# EAGLE design multi_sense32_re1 (EAGLE 9.6.2)
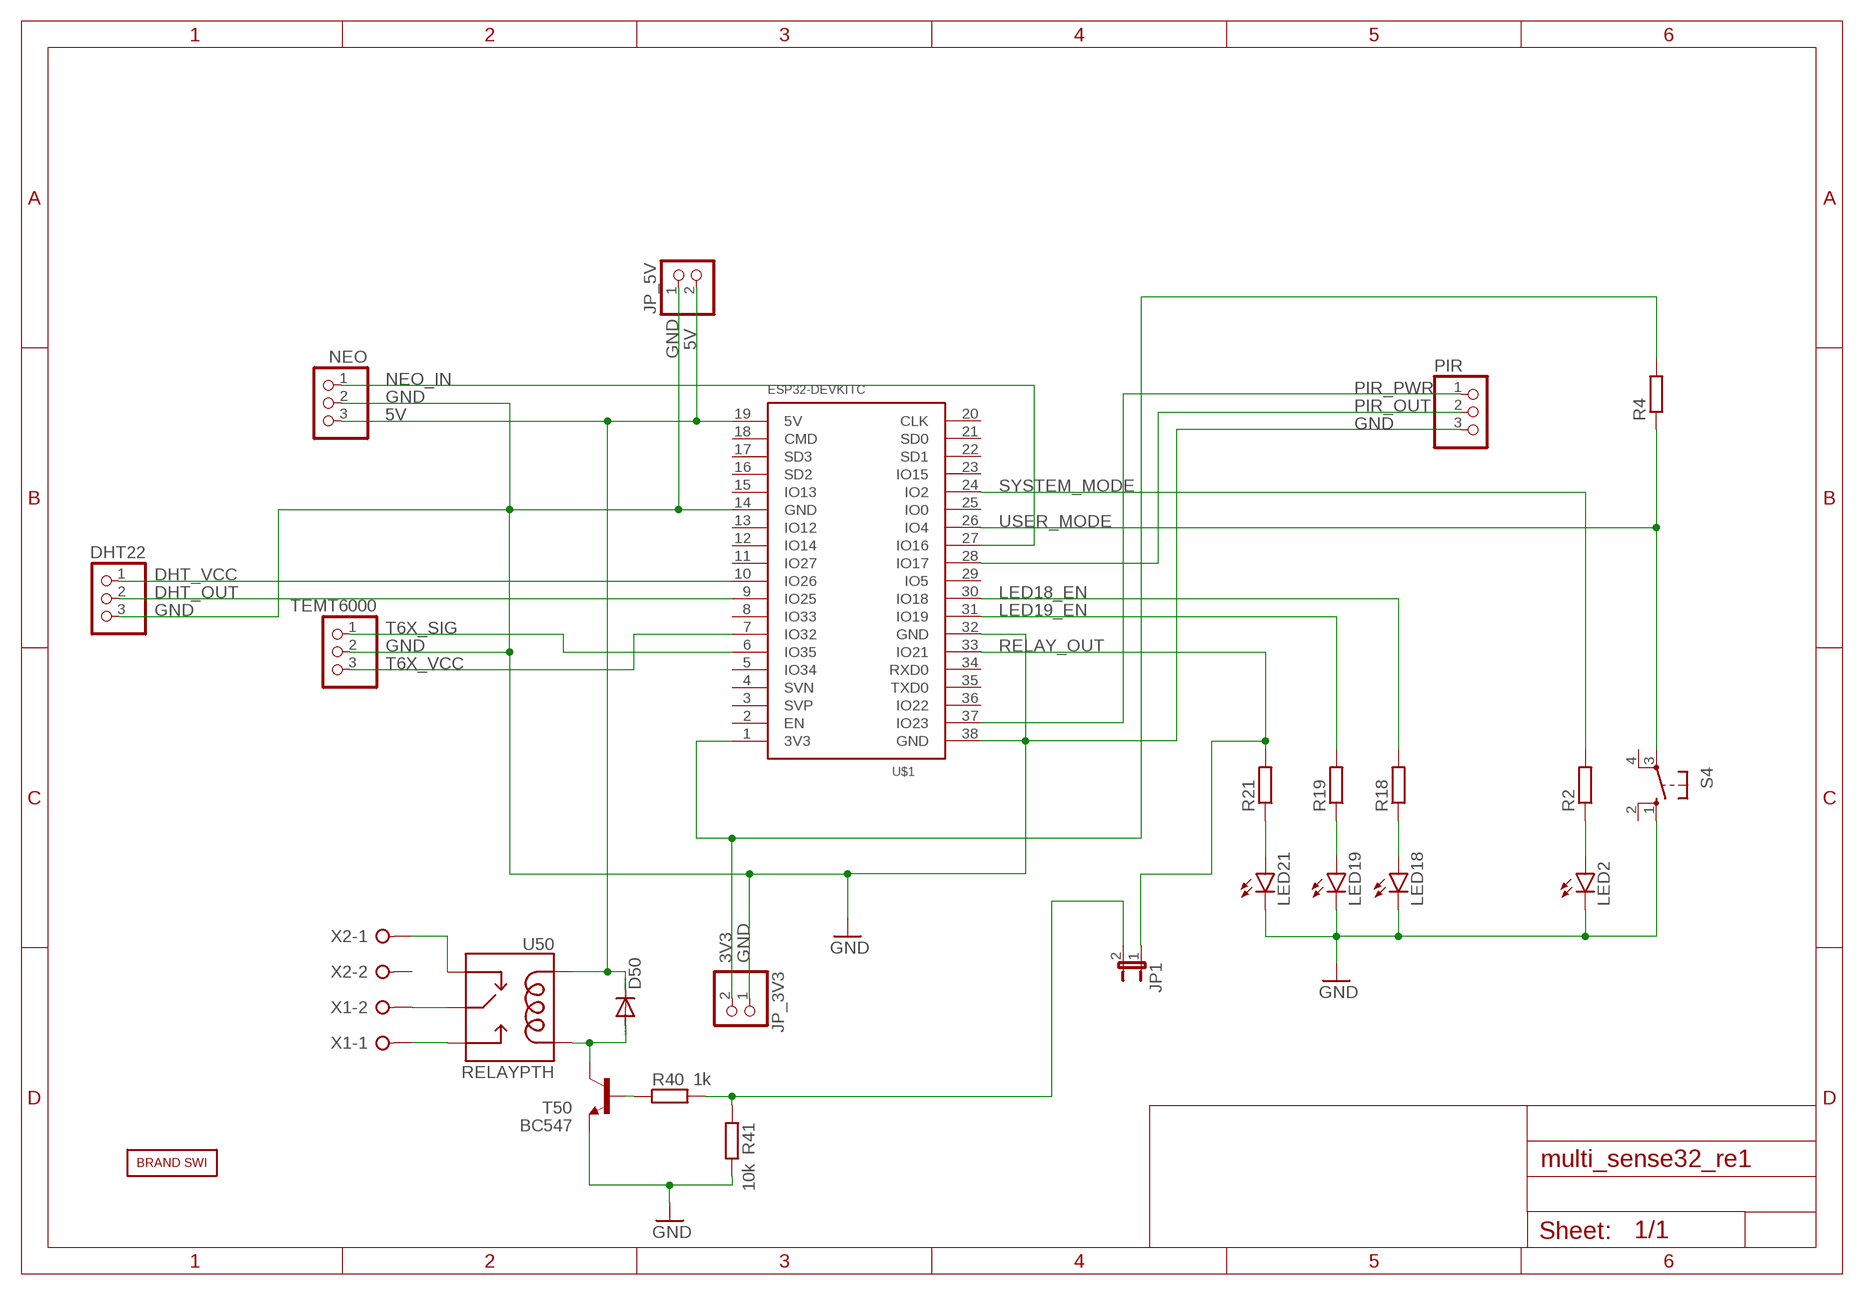
[diagram p0: schematic, sheet 1]

## Parts
D50  1N4148DO35-7  [DO35-7]
DHT22  PINHD-1X3  [1X03]
JP1  JP1E  [JP1]
JP_3V3  PINHD-1X2  [1X02]
JP_5V  PINHD-1X2  [1X02]
LED2  LEDCHIPLED_1206  [CHIPLED_1206]
LED18  LEDCHIPLED_1206  [CHIPLED_1206]
LED19  LEDCHIPLED_1206  [CHIPLED_1206]
LED21  LEDCHIPLED_1206  [CHIPLED_1206]
NEO  PINHD-1X3  [1X03]
PIR  PINHD-1X3  [1X03]
R2  R-EU_R1206  [R1206]
R4  R-EU_R1206  [R1206]
R18  R-EU_R1206  [R1206]
R19  R-EU_R1206  [R1206]
R21  R-EU_R1206  [R1206]
R40  1k  R-EU_0207/10  [0207/10]
R41  10k  R-EU_0207/10  [0207/10]
S4  10-XX  [B3F-10XX]
T50  BC547  [TO92]
TEMT6000  PINHD-1X3  [1X03]
U50  RELAYPTH  [SRD-05VDC-SL-C]
U$1  ESP32DEVKITC  [ESP32-DEVKITC]
U$2  BRAND_SWI5X7  [BRAND_SWI_5X7]
X1  W237-02P  [W237-132]
X2  W237-02P  [W237-132]

## Nets
3V3: JP_3V3.2 R4.2 U$1.1(3V3)
5V: D50.C JP_5V.2 NEO.3 U50.COIL1 U$1.19(5V)
DHT_OUT: DHT22.2 U$1.9(IO25)
DHT_VCC: DHT22.1 U$1.10(IO26)
GND: DHT22.3 JP_3V3.1 JP_5V.1 LED2.C LED18.C LED19.C LED21.C NEO.2 PIR.3 R41.2 S4.1(S) T50.1(E) TEMT6000.2 U$1.14(GND) U$1.32(GND) U$1.38(GND)
LED18_EN: R18.2 U$1.30(IO18)
LED19_EN: R19.2 U$1.31(IO19)
LED21_EN: JP1.2 R40.2 R41.1
N$1: U50.SWOPEN X1.1
N$2: LED21.A R21.1
N$3: U50.SWCOMMON X1.2
N$4: LED19.A R19.1
N$5: LED18.A R18.1
N$7: U50.SWCLOSED(SWCLOSE) X2.1
N$9: LED2.A R2.1
N$22: D50.A T50.3(C) U50.COIL0
N$27: R40.1 T50.2(B)
NEO_IN: NEO.1 U$1.27(IO16)
PIR_OUT: PIR.2 U$1.28(IO17)
PIR_PWR: PIR.1 U$1.37(IO23)
RELAY_OUT: JP1.1 R21.2 U$1.33(IO21)
SYSTEM_MODE: R2.2 U$1.24(IO2)
T6X_SIG: TEMT6000.1 U$1.6(IO35)
T6X_VCC: TEMT6000.3 U$1.7(IO32)
USER_MODE: R4.1 S4.3(P) U$1.26(IO4)
Unconnected: S4.2(S1) S4.4(P1) U$1.2(EN) U$1.3(SVP) U$1.4(SVN) U$1.5(IO34) U$1.8(IO33) U$1.11(IO27) U$1.12(IO14) U$1.13(IO12) U$1.15(IO13) U$1.16(SD2) U$1.17(SD3) U$1.18(CMD) U$1.20(CLK) U$1.21(SD0) U$1.22(SD1) U$1.23(IO15) U$1.25(IO0) U$1.29(IO5) U$1.34(RXD0) U$1.35(TXD0) U$1.36(IO22) X2.2

## Library data of the parts
D50 = diode:1N4148: DIODE high speed (Philips)
DHT22 NEO PIR TEMT6000 = pinhead:PINHD-1X3: PIN HEADER
JP1 = jumper:JP1E: JUMPER
JP_3V3 JP_5V = pinhead:PINHD-1X2: PIN HEADER
LED2 LED18 LED19 LED21 = led:LED: LED OSRAM: - CHIPLED LG R971, LG N971, LY N971, LG Q971, LY Q971, LO R971, LY R971 LH N974, LH R974 LS Q976, LO Q976, LY Q976 LO Q996 - Hyper CHIPLED LW Q18S LB Q993, LB Q99A, LB R99A - SideLED LS A670, LO A670, LY A670, LG A670, LP A670 LB A673, LV A673, LT A673, LW A673 LH A674 LY A675 LS A676, LA A676, LO A676, LY A676, LW A676 LS A679, LY A679, LG A679 - Hyper Micro SIDELED® LS Y876, LA Y876, LO Y876, LY Y876 LT Y87S - SmartLED LW L88C, LW L88S LB L89C, LB L89S, LG L890 LS L89K, LO L89K, LY L89K LS L896, LA L896, LO L896, LY L896 - TOPLED LS T670, LO T670, LY T670, LG T670, LP T670 LSG T670, LSP T670, LSY T670, LOP T670, LYG T670 LG T671, LOG T671, LSG T671 LB T673, LV T673, LT T673, LW T673 LH T674 LS T676, LA T676, LO T676, LY T676, LB T676, LH T676, LSB T676, LW T676 LB T67C, LV T67C, LT T67C, LS T67K, LO T67K, LY T67K, LW E67C LS E67B, LA E67B, LO E67B, LY E67B, LB E67C, LV E67C, LT E67C LW T67C LS T679, LY T679, LG T679 LS T770, LO T770, LY T770, LG T770, LP T770 LB T773, LV T773, LT T773, LW T773 LH T774 LS E675, LA E675, LY E675, LS T675 LS T776, LA T776, LO T776, LY T776, LB T776 LHGB T686 LT T68C, LB T68C - Hyper Mini TOPLED® LB M676 - Mini TOPLED Santana® LG M470 LS M47K, LO M47K, LY M47K Source: http://www.osram.convergy.de LUXEON: - LUMILED® LXK2-PW12-R00, LXK2-PW12-S00, LXK2-PW14-U00, LXK2-PW14-V00 LXK2-PM12-R00, LXK2-PM12-S00, LXK2-PM14-U00 LXK2-PE12-Q00, LXK2-PE12-R00, LXK2-PE12-S00, LXK2-PE14-T00, LXK2-PE14-U00 LXK2-PB12-K00, LXK2-PB12-L00, LXK2-PB12-M00, LXK2-PB14-N00, LXK2-PB14-P00, LXK2-PB14-Q00 LXK2-PR12-L00, LXK2-PR12-M00, LXK2-PR14-Q00, LXK2-PR14-R00 LXK2-PD12-Q00, LXK2-PD12-R00, LXK2-PD12-S00 LXK2-PH12-R00, LXK2-PH12-S00 LXK2-PL12-P00, LXK2-PL12-Q00, LXK2-PL12-R00 Source: www.luxeon.com KINGBRIGHT: KA-3528ASYC Source: www.kingbright.com
R2 R4 R18 R19 R21 R40 R41 = rcl:R-EU_: RESISTOR, European symbol; SPICEPREFIX: R
S4 = switch-omron:10-XX: OMRON SWITCH; MPN: B3F-1000; OC_FARNELL: 176432; OC_NEWARK: 36M3542
T50 = transistor:BC547: NPN TRANSISTOR
U50 = SWI_COMMONS:RELAY: SPDT relay (COM-00101)
U$1 = SWI_COMMONS:ESP32DEVKITC
U$2 = BRAND_SWI:BRAND_SWI
X1 X2 = con-wago-508:W237-02P: WAGO SREW CLAMP; OC_FARNELL: unknown; OC_NEWARK: unknown

## Board
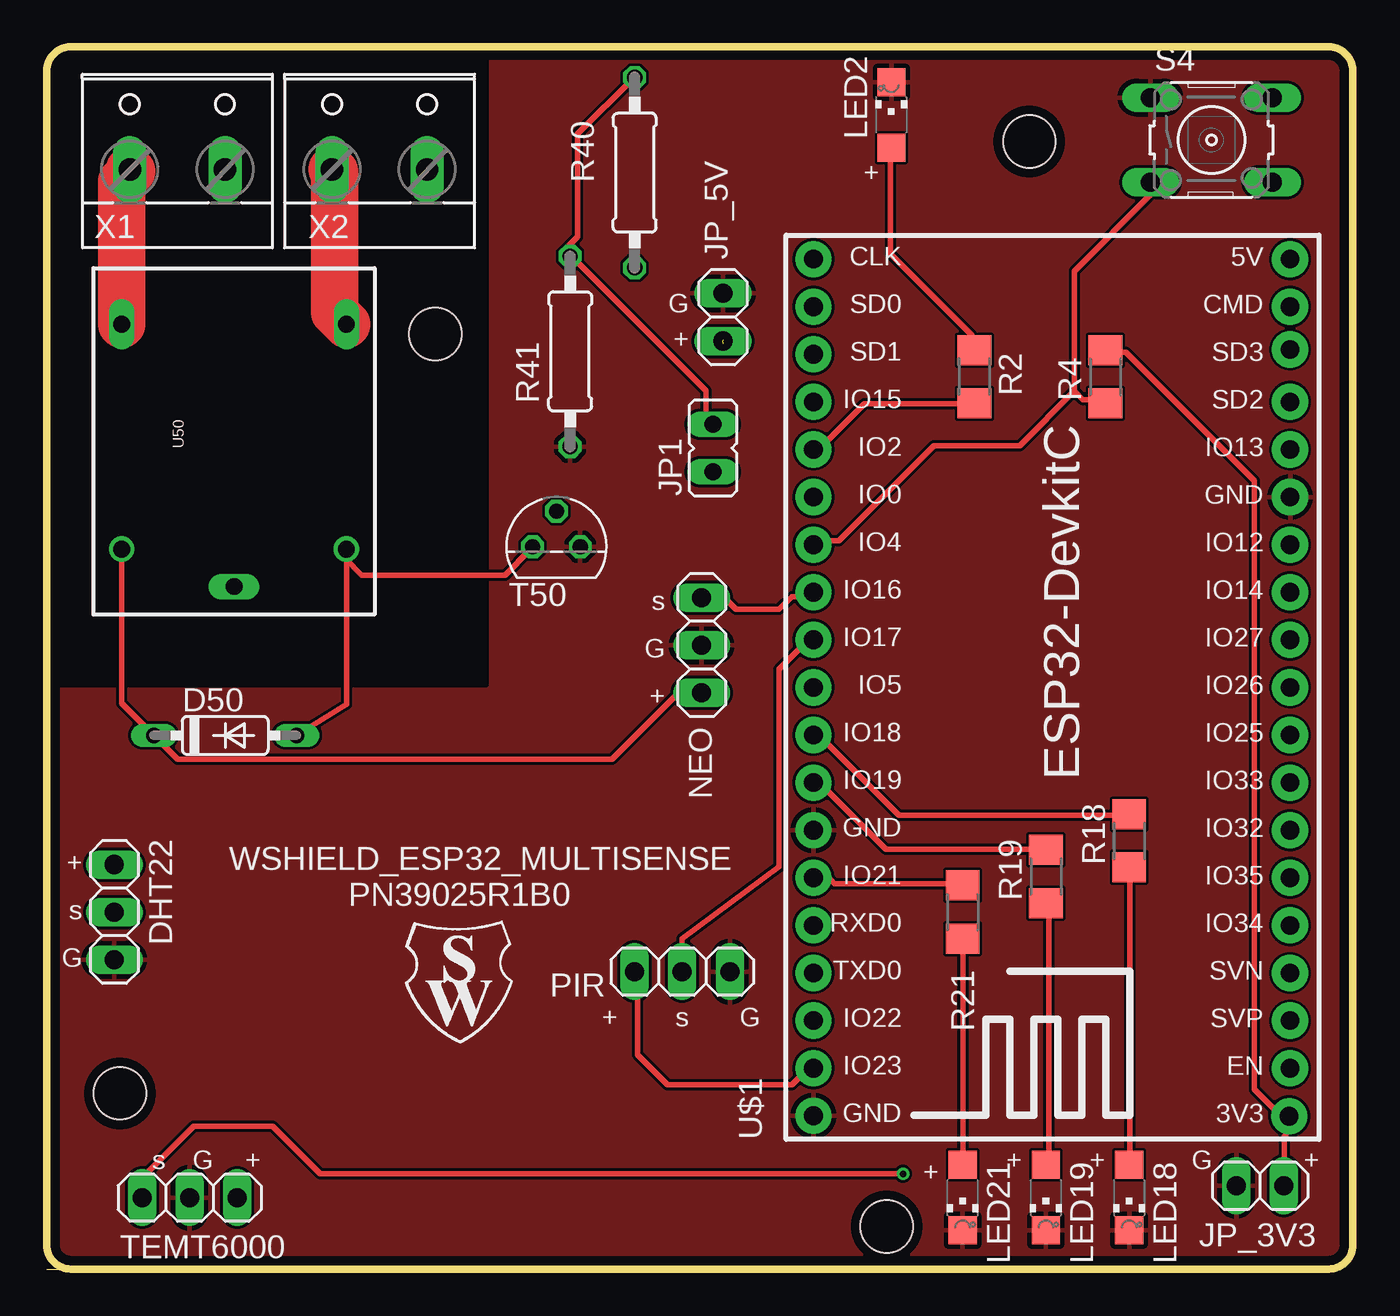
[diagram p1: board, top side]
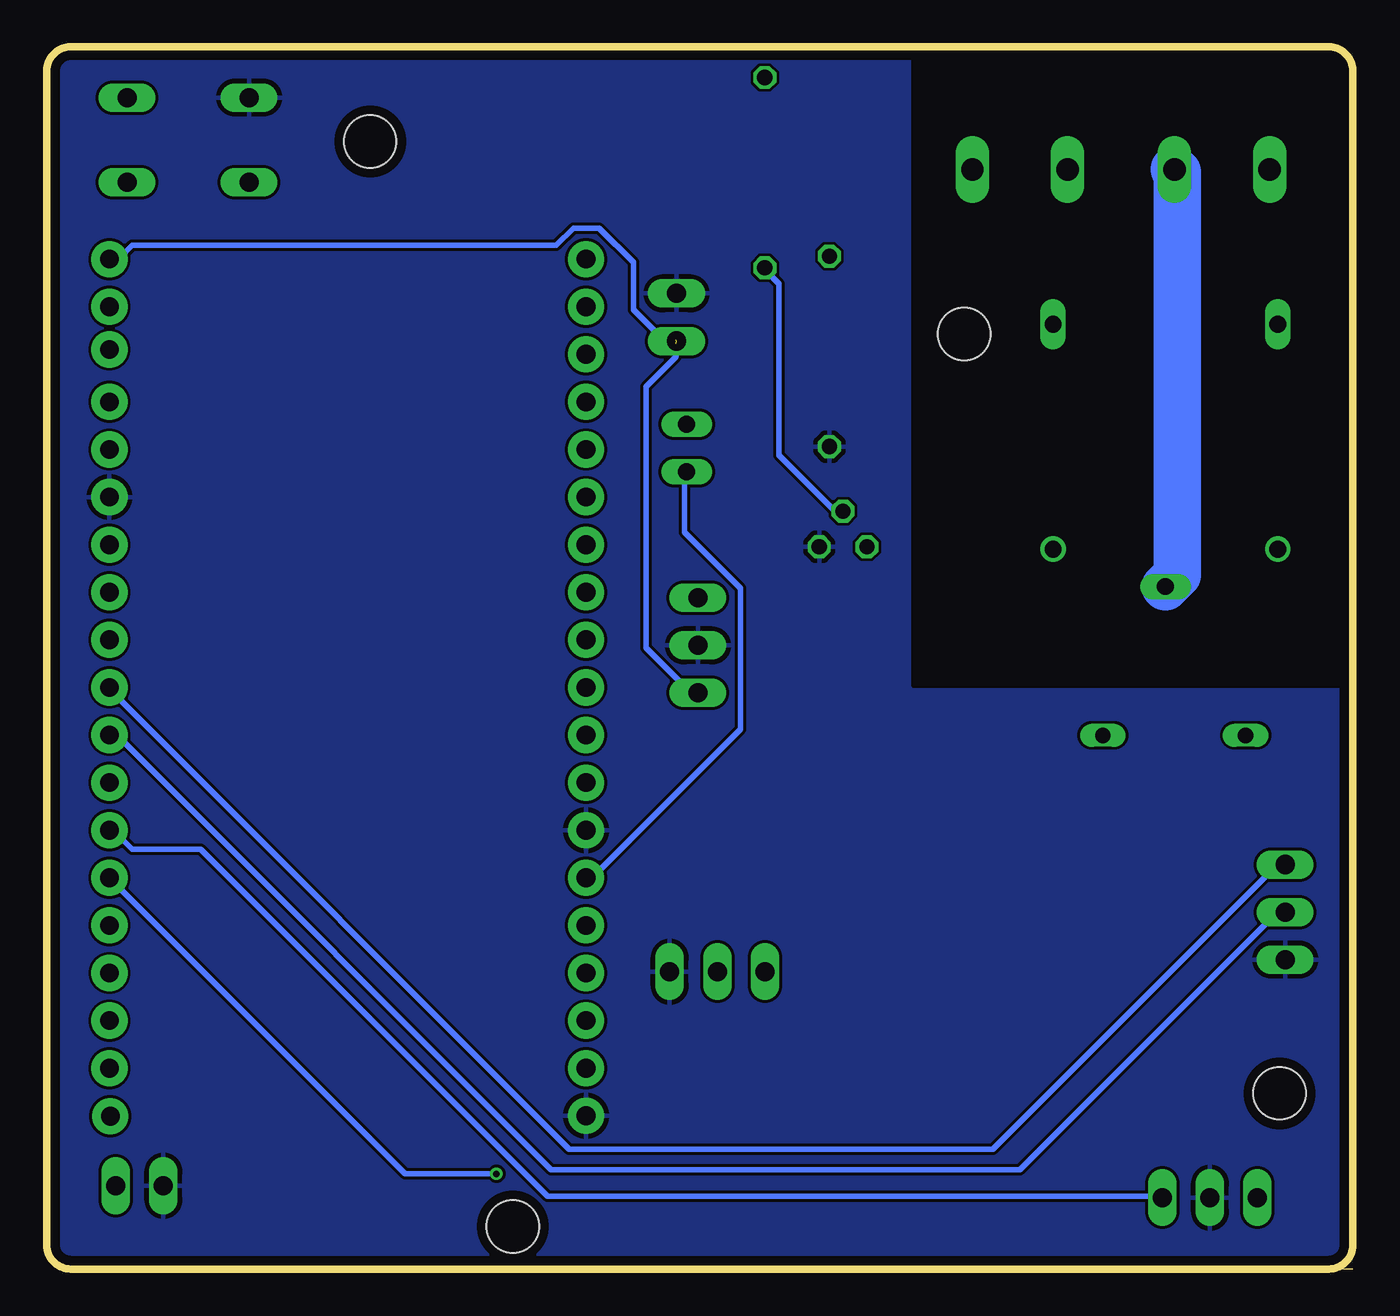
[diagram p2: board, bottom side, seen from below]

Size 69.72 x 65.23 mm. Coordinates in mm from the lower left corner, seen from the top.
Outline: 0,0 1.27,0
Outline: 1.27,0 2.03,0
Outline: 28.45,0 31.42,0
Outline: 1.27,0 68.45,0 arc90 69.72,1.27 69.72,63.96 arc90 68.45,65.23 1.27,65.23 arc90 0,63.96 0,1.27 arc90 1.27,0
Copper layers (1*16): Top 0.035mm / dielectric 1.6mm / Bottom 0.035mm
Design rules "Elecrow_2-layer_PCB_eagle_rule": minimum track width 6mil, minimum drill 12mil, track to track 6mil, track to pad 6mil, pad to pad 6mil, via to via 8mil, smd to smd 0mil, copper to edge 20mil, drill to drill 10mil, minimum pad ring 6mil, minimum via ring 6mil, stop-mask expansion 0mil, vias tented up to drill 100mil, thermal gap 10mil
Holes 2.8 mm at 3.9,9.38 52.45,60.18 44.84,2.27 20.75,49.91
tRestrict: area 0,31.1 to 23.5,65.4
bRestrict: area 0,31.1 to 23.5,65.4

### Footprints (pad centres in the part's own frame; a part is rotated, then mirrored left to right if it is on the bottom)
DO35-7 = drill 0.813 long: A 3.81,0; C -3.81,0
1X03 = drill 1.016 long: 1 -2.54,0; 2 0,0; 3 2.54,0
JP1 = drill 0.914 long: 1 0,-1.27; 2 0,1.27
1X02 = drill 1.016 long: 1 -1.27,0; 2 1.27,0
CHIPLED_1206 = smd 1.5 x 1.5: A 0,-1.75; C 0,1.75
R1206 = smd 1.6 x 1.803: 1 -1.422,0; 2 1.422,0
0207/10 = drill 0.813 octagon: 1 -5.08,0; 2 5.08,0
B3F-10XX = drill 1.016 long: 1 -3.251,2.261; 2 3.251,2.261; 3 -3.251,-2.261; 4 3.251,-2.261
TO92 = drill 0.813 octagon: 1 1.27,0; 2 0,1.905; 3 -1.27,0
SRD-05VDC-SL-C = drill 0.9: COIL0 -5.39,-6.12; COIL1 -5.39,5.88 | drill 0.9 long: SWCLOSED 6.61,-6.12; SWCOMMON -7.39,-0.12; SWOPEN 6.61,5.88
ESP32-DEVKITC = drill 1 pad 1.93: 1 -22.895,-14.163; 2 -20.33,-14.214; 3 -17.79,-14.214; 4 -15.25,-14.214; 5 -12.71,-14.214; 6 -10.17,-14.214; 7 -7.63,-14.214; 8 -5.09,-14.214; 9 -2.55,-14.214; 10 -0.01,-14.214; 11 2.53,-14.214; 12 5.07,-14.214; 13 7.61,-14.214; 14 10.15,-14.214; 15 12.69,-14.214; 16 15.23,-14.214; 17 18.024,-14.214; 18 20.31,-14.214; 19 22.85,-14.214; 20 22.85,11.23; 21 20.31,11.23; 22 17.77,11.23; 23 15.23,11.23; 24 12.69,11.23; 25 10.15,11.23; 26 7.61,11.23; 27 5.07,11.23; 28 2.53,11.23; 29 -0.01,11.23; 30 -2.55,11.23; 31 -5.09,11.23; 32 -7.63,11.23; 33 -10.17,11.23; 34 -12.71,11.23; 35 -15.25,11.23; 36 -17.79,11.23; 37 -20.33,11.23; 38 -22.87,11.23
W237-132 = drill 1.194 long: 1 -2.54,-0.635; 2 2.54,-0.635

### Placement (x,y rotation side)
D50  9.53,28.48 0 top
DHT22  3.6,19.05 270 top
JP1  35.56,43.81 0 top
JP_3V3  64.77,4.45 0 top
JP_5V  36.1,50.8 270 top
LED2  45.09,61.59 0 top
LED18  57.78,3.81 180 top
LED19  53.34,3.81 180 top
LED21  48.9,3.81 180 top
NEO  34.97,33.29 270 top
PIR  33.92,15.88 0 top
R2  49.53,47.62 270 top
R4  56.52,47.62 90 top
R18  57.78,22.86 90 top
R19  53.34,20.95 90 top
R21  48.9,19.05 90 top
R40  31.39,58.52 90 top
R41  27.94,48.98 270 top
S4  62.18,60.26 0 top
T50  27.21,38.55 0 top
TEMT6000  7.62,3.81 0 top
U50  9.88,43.81 90 top
U$1  52.16,31.05 90 top
U$2  18.93,11.9 0 top
X1  6.97,59.33 0 top
X2  17.77,59.33 0 top

### Tracks (layer width: path | path; a pad name or v marks a point on that pad's centre or on a via)
3V3
  Top 0.305: R4.2 56.69,48.92 57.61,48.92 64.47,42.06 64.47,9.6 65.84,8.23 66.29,8.23 U$1.1 66.29,8 66.29,7.32 66.06,7.09 66.06,4.57 JP_3V3.2
5V  (2 unrouted)
  Top 0.305: NEO.3 34.75,30.63 33.6,30.63 30.18,27.2 6.99,27.2 D50.C 4,30.2 U50.COIL1
  Bottom 0.305: 36.12,49.38 36.12,48.69 37.72,47.09 37.72,33.15 35.43,30.86 34.98,30.86 NEO.3 | 36.12,49.61 36.8,49.61 38.41,51.21 38.41,53.72 40.23,55.55 41.6,55.55 42.52,54.63 65.15,54.63 65.84,53.95 66.29,53.95 U$1.19
DHT_OUT
  Bottom 0.305: DHT22.2 3.66,18.97 4.12,18.97 17.78,5.31 42.8,5.31 65.84,28.35 66.29,28.35 U$1.9
DHT_VCC
  Bottom 0.305: DHT22.1 3.66,21.49 4.12,21.49 19.2,6.4 41.83,6.4 66.29,30.86 U$1.10
GND
  pour Top: 0,65.41 69.85,65.41 69.85,64.77 69.85,0 0,0
  pour Bottom: 0,65.41 69.85,65.41 69.85,64.14 69.85,0 0,0
LED18_EN
  Top 0.305: R18.2 57.61,24.23 45.49,24.23 41.15,28.57 U$1.30
LED19_EN
  Top 0.305: R19.2 53.26,22.4 44.81,22.4 41.15,26.06 U$1.31
LED21_EN
  Top 0.305: JP1.2 35.43,45.26 35.2,45.49 35.2,46.86 28.12,53.95 R41.1 27.89,54.18 27.89,54.63 28.35,55.09 28.35,60.58 31.32,63.55 R40.2
N$1
  Top 2.54: U50.SWOPEN 4,58.05 4.54,58.59 X1.1
N$2
  Top 0.305: LED21.A 48.92,5.71 48.92,17.6 R21.1
N$3
  Bottom 2.54: U50.SWCOMMON 9.36,37.06 9.36,58.54 X1.2
N$4
  Top 0.305: LED19.A 53.49,5.71 53.49,19.43 R19.1
N$5
  Top 0.305: LED18.A 57.84,5.71 57.84,21.26 R18.1
N$7
  Top 2.54: X2.1 15.36,58.55 15.36,51.06 U50.SWCLOSED
N$9
  Top 0.305: LED2.A 45.03,59.66 45.03,54.18 49.38,49.84 49.38,49.15 R2.1
N$22
  Top 0.305: 16,37.95 16,30.14 D50.A | 16,37.95 15.95,37.9 16.82,37.03 24.46,37.03 25.83,38.41 T50.3 | 16,37.95 16,38.41 U50.COIL0
N$27
  Bottom 0.305: T50.2 27.43,40.46 27.66,40.46 30.63,43.43 30.63,52.58 31.09,53.03 31.09,53.26 31.32,53.49 R40.1
NEO_IN
  Top 0.305: NEO.1 34.98,35.66 36.35,35.66 36.8,35.2 39.09,35.2 39.78,35.89 40.69,35.89 40.92,36.12 U$1.27
PIR_OUT
  Top 0.305: PIR.2 33.92,17.62 39.09,21.47 39.09,32 40.46,33.38 40.92,33.38 U$1.28
PIR_PWR
  Top 0.305: PIR.1 31.55,15.75 31.55,11.43 33.15,9.83 39.78,9.83 40.46,10.52 40.92,10.52 U$1.37
RELAY_OUT
  Top 0.305: R21.2 48.69,20.57 42.06,20.57 41.83,20.8 41.15,20.8 U$1.33
  Bottom 0.305: JP1.1 35.66,42.52 35.66,39.32 32.69,36.35 32.69,28.8 40.46,21.03 40.92,21.03 U$1.33
SYSTEM_MODE
  Top 0.305: R2.2 49.38,46.18 43.66,46.18 41.15,43.66 U$1.24
T6X_SIG  (via drill 0.35)
  Top 0.305: TEMT6000.1 5.26,3.89 5.26,5.03 7.85,7.62 12.06,7.62 14.61,5.08 v45.72,5.08
  Bottom 0.305: U$1.6 50.58,5.08 v45.72,5.08
T6X_VCC
  Bottom 0.305: TEMT6000.3 10.29,3.89 42.98,3.89 61.49,22.4 65.15,22.4 66.29,23.55 U$1.7
USER_MODE
  Top 0.305: 54.86,46.86 55.32,46.41 56.46,46.41 R4.1 | 54.86,46.86 54.86,53.26 58.98,57.38 58.98,57.84 S4.3 | 54.86,46.86 51.94,43.94 47.37,43.94 42.29,38.86 41.15,38.86 U$1.26

### Text on the board
tNames: + | G | + | s | G | + | + | WSHIELD_ESP32_MULTISENSE | s | PN39025R1B0 | G | + | s | G | s | G | + | + | + | + | G | +